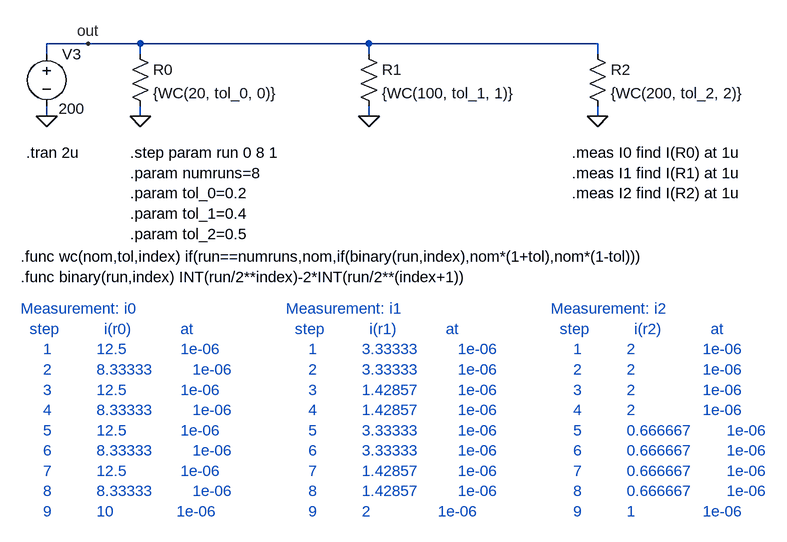
[diagram p0: schematic Fig_11-38_TEST_RUN-Index_3R.asc]
Fig_11-38_TEST_RUN-Index_3R.asc, the LTspice schematic file:
Version 4
SHEET 1 1860 1840
WIRE -752 176 -816 176
WIRE -672 176 -752 176
WIRE -320 176 -672 176
WIRE 32 176 -320 176
WIRE -816 192 -816 176
WIRE -672 192 -672 176
WIRE -320 192 -320 176
WIRE 32 192 32 176
WIRE -816 288 -816 272
WIRE -672 288 -672 272
WIRE -320 288 -320 272
WIRE 32 288 32 272
FLAG -816 288 0
FLAG -672 288 0
FLAG -752 176 out
FLAG -320 288 0
FLAG 32 288 0
SYMBOL voltage -816 176 R0
WINDOW 3 18 100 Left 2
WINDOW 123 -46 207 Left 2
WINDOW 39 0 0 Left 0
SYMATTR Value 200
SYMATTR InstName V3
SYMBOL res -688 176 R0
SYMATTR InstName R0
SYMATTR Value {WC(20, tol_0, 0)}
SYMBOL res -336 176 R0
SYMATTR InstName R1
SYMATTR Value {WC(100, tol_1, 1)}
SYMBOL res 16 176 R0
SYMATTR InstName R2
SYMATTR Value {WC(200, tol_2, 2)}
TEXT -848 344 Left 2 !.tran 2u
TEXT -688 344 Left 2 !.step param run 0 8 1\n.param numruns=8\n.param tol_0=0.2\n.param tol_1=0.4\n.param tol_2=0.5
TEXT -856 504 Left 2 !.func wc(nom,tol,index) if(run==numruns,nom,if(binary(run,index),nom*(1+tol),nom*(1-tol)))\n.func binary(run,index) INT(run/2**index)-2*INT(run/2**(index+1))
TEXT -8 344 Left 2 !.meas I0 find I(R0) at 1u\n.meas I1 find I(R1) at 1u\n.meas I2 find I(R2) at 1u
TEXT -448 584 Left 2 ;Measurement: i1\n  step          i(r1)           at\n     1          3.33333         1e-06\n     2          3.33333         1e-06\n     3          1.42857         1e-06\n     4          1.42857         1e-06\n     5          3.33333         1e-06\n     6          3.33333         1e-06\n     7          1.42857         1e-06\n     8          1.42857         1e-06\n     9          2               1e-06
TEXT -856 584 Left 2 ;Measurement: i0\n  step          i(r0)           at\n     1          12.5            1e-06\n     2          8.33333         1e-06\n     3          12.5            1e-06\n     4          8.33333         1e-06\n     5          12.5            1e-06\n     6          8.33333         1e-06\n     7          12.5            1e-06\n     8          8.33333         1e-06\n     9          10              1e-06
TEXT -40 584 Left 2 ;Measurement: i2\n  step          i(r2)           at\n     1          2               1e-06\n     2          2               1e-06\n     3          2               1e-06\n     4          2               1e-06\n     5          0.666667        1e-06\n     6          0.666667        1e-06\n     7          0.666667        1e-06\n     8          0.666667        1e-06\n     9          1               1e-06

The netlist it stands for:
* Fig_11-38_TEST_RUN-Index_3R.asc
V3 out 0 200
R0 out 0 {WC(20, tol_0, 0)}
R1 out 0 {WC(100, tol_1, 1)}
R2 out 0 {WC(200, tol_2, 2)}
.tran 2u
.step param run 0 8 1
.param numruns=8
.param tol_0=0.2
.param tol_1=0.4
.param tol_2=0.5
.func wc(nom,tol,index) if(run==numruns,nom,if(binary(run,index),nom*(1+tol),nom*(1-tol)))
.func binary(run,index) INT(run/2**index)-2*INT(run/2**(index+1))
.meas I0 find I(R0) at 1u
.meas I1 find I(R1) at 1u
.meas I2 find I(R2) at 1u
* Measurement: i1
*   step          i(r1)           at
*      1          3.33333         1e-06
*      2          3.33333         1e-06
*      3          1.42857         1e-06
*      4          1.42857         1e-06
*      5          3.33333         1e-06
*      6          3.33333         1e-06
*      7          1.42857         1e-06
*      8          1.42857         1e-06
*      9          2               1e-06
* Measurement: i0
*   step          i(r0)           at
*      1          12.5            1e-06
*      2          8.33333         1e-06
*      3          12.5            1e-06
*      4          8.33333         1e-06
*      5          12.5            1e-06
*      6          8.33333         1e-06
*      7          12.5            1e-06
*      8          8.33333         1e-06
*      9          10              1e-06
* Measurement: i2
*   step          i(r2)           at
*      1          2               1e-06
*      2          2               1e-06
*      3          2               1e-06
*      4          2               1e-06
*      5          0.666667        1e-06
*      6          0.666667        1e-06
*      7          0.666667        1e-06
*      8          0.666667        1e-06
*      9          1               1e-06
.backanno
.end